# EAGLE design Un_Usb (EAGLE 6.2)
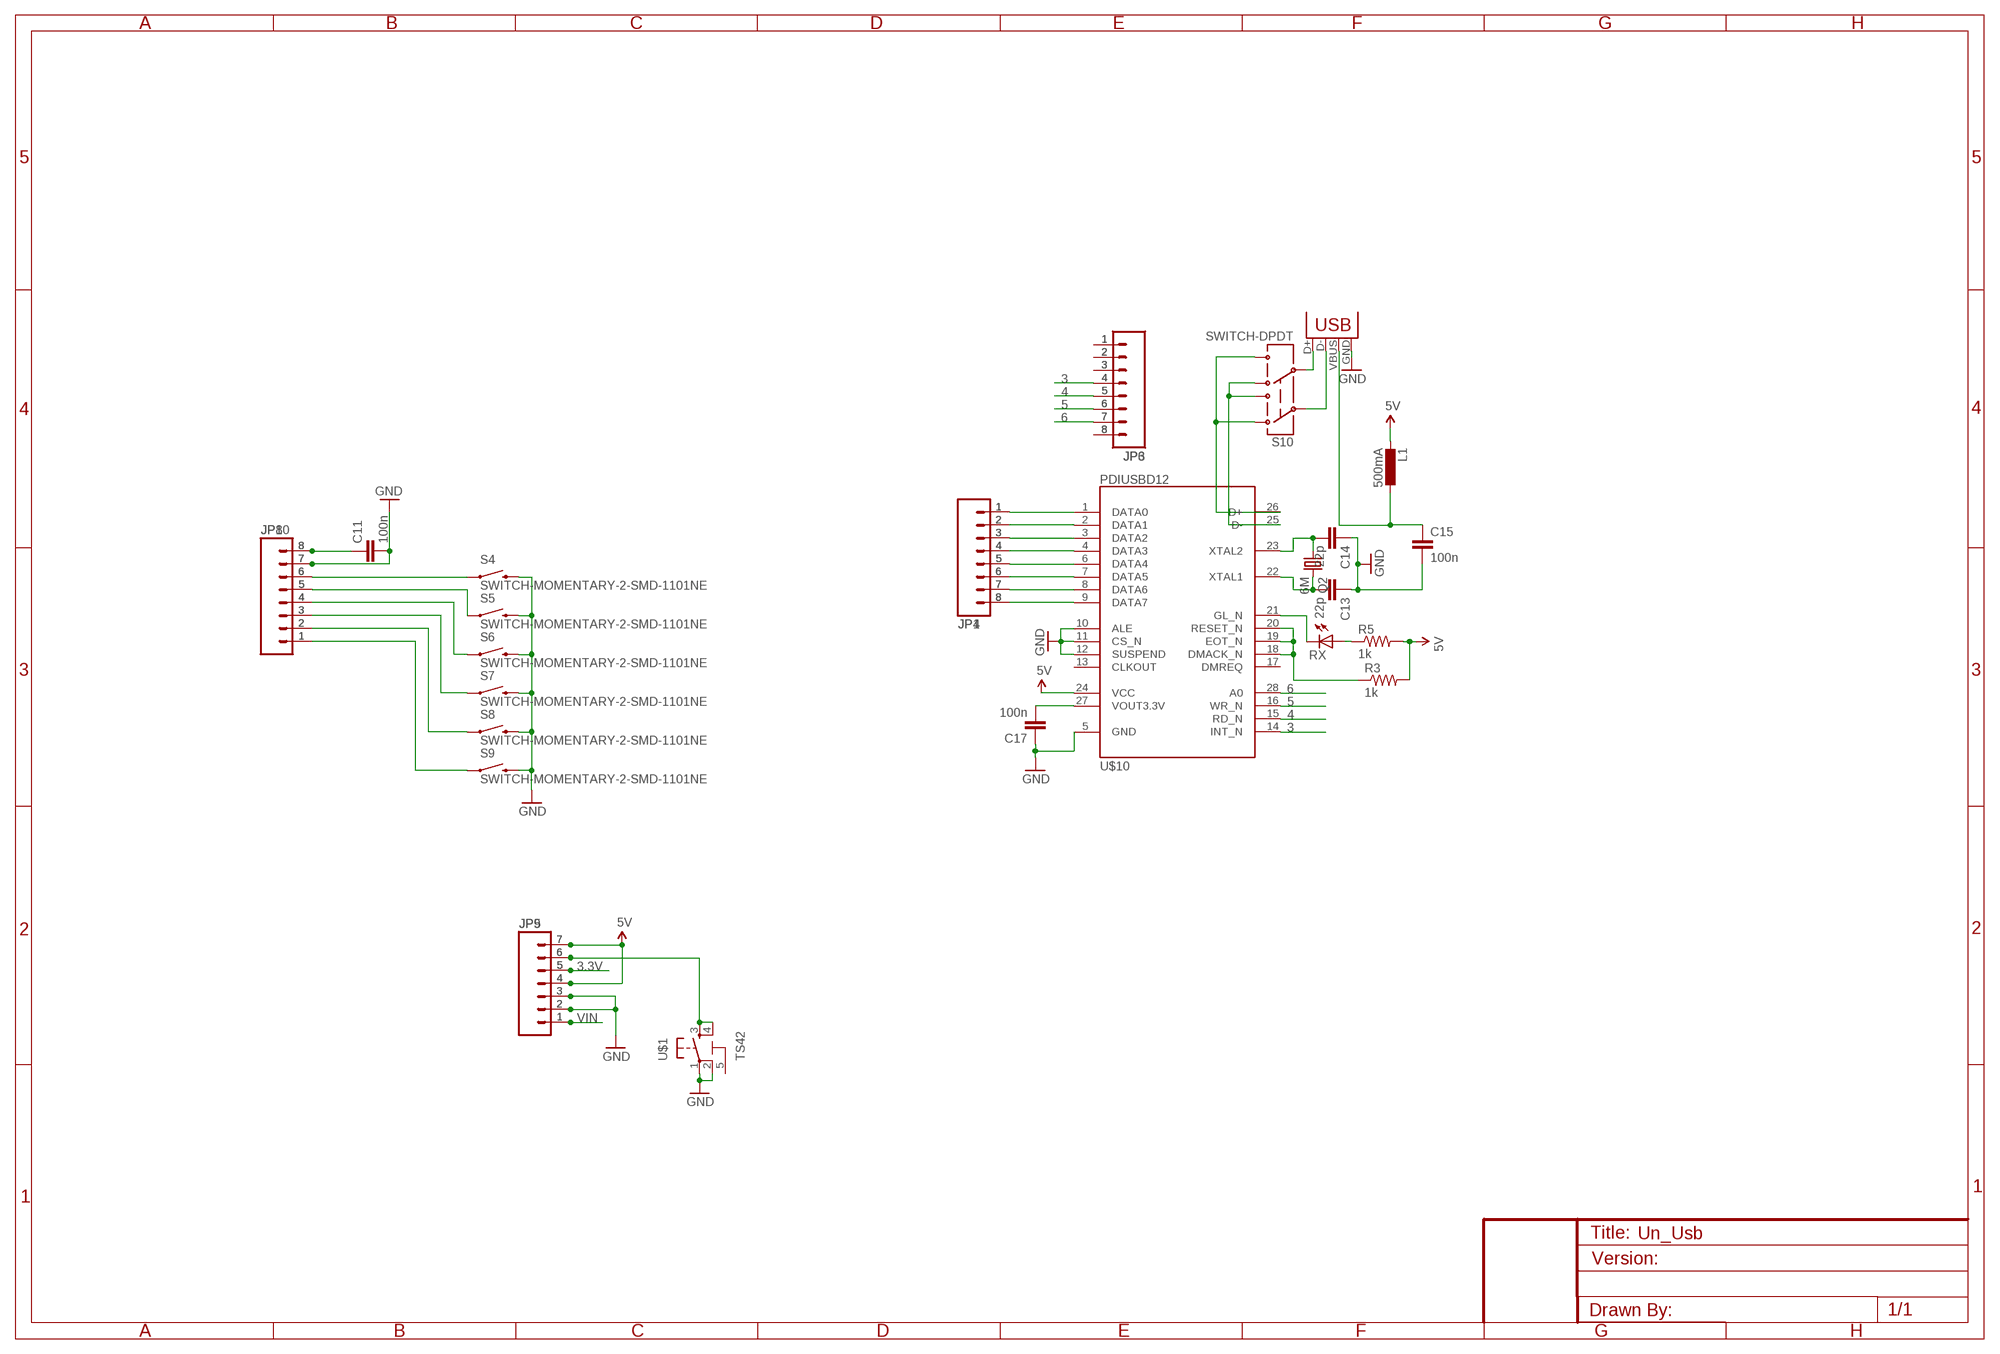
[diagram p0: schematic, sheet 1]

## Parts
C11  100n  CAP0603-CAP  [0603-CAP]
C13  22p  CAP0805  [0805]
C14  22p  CAP0805  [0805]
C15  100n  CAP0603-CAP  [0603-CAP]
C17  100n  CAP0603-CAP  [0603-CAP]
JP1  M081X08  [1X08]
JP3  M08  [1X08]
JP4  M081X08  [1X08]
JP5  M07  [1X07]
JP6  M08  [1X08]
JP8  M08  [1X08]
JP9  M07  [1X07]
JP10  M08  [1X08]
L1  500mA  L-EUL1812  [L1812]
Q2  6M  CRYSTALHC49US  [HC49US]
R3  1k  RESISTOR0805-RES  [0805]
R5  1k  RESISTOR0805-RES  [0805]
RX  LED0805  [LED-0805]
S4  SWITCH-MOMENTARY-2-SMD-1101NE  [TACTILE-SWITCH-1101NE]
S5  SWITCH-MOMENTARY-2-SMD-1101NE  [TACTILE-SWITCH-1101NE]
S6  SWITCH-MOMENTARY-2-SMD-1101NE  [TACTILE-SWITCH-1101NE]
S7  SWITCH-MOMENTARY-2-SMD-1101NE  [TACTILE-SWITCH-1101NE]
S8  SWITCH-MOMENTARY-2-SMD-1101NE  [TACTILE-SWITCH-1101NE]
S9  SWITCH-MOMENTARY-2-SMD-1101NE  [TACTILE-SWITCH-1101NE]
S10  SWITCH-DPDT  [SWITCH-P2]
U$1  TS42  [TS42]
U$10  PDIUSBD12  [TSSOP28]
X2  USB  [USB-A-M]

## Nets
2: JP3.3 JP6.3
3: JP3.4 JP6.4 U$10.14(INT_N)
3.3V: JP5.5 JP9.5
4: JP3.5 JP6.5 U$10.15(RD_N)
5: JP3.6 JP6.6 U$10.16(WR_N)
5V: JP5.4 JP5.7 JP9.4 JP9.7 L1.2 R3.2 R5.2 U$10.24(VCC)
6: JP3.7 JP6.7 U$10.28(A0)
A0: JP1.1 JP4.1 U$10.1(DATA0)
AREF: C11.1 JP8.8 JP10.8
D+: S10.1 S10.6 U$10.26(D+)
D-: S10.3 S10.4 U$10.25(D-)
GND: C11.2 C13.1 C14.1 C15.2 C17.1 JP5.2 JP5.3 JP8.7 JP9.2 JP9.3 JP10.7 S4.P$2 S5.P$2 S6.P$2 S7.P$2 S8.P$2 S9.P$2 U$1.1 U$1.2 U$10.5(GND) U$10.10(ALE) U$10.11(CS_N) U$10.12(SUSPEND) X2.GND
IO0: JP3.1 JP6.1
N$1: JP1.8 JP4.8 U$10.9(DATA7)
N$2: JP3.8 JP6.8
N$3: JP1.7 JP4.7 U$10.8(DATA6)
N$5: JP1.6 JP4.6 U$10.7(DATA5)
N$6: JP1.5 JP4.5 U$10.6(DATA4)
N$7: R5.1 RX.1(A)
N$8: JP1.4 JP4.4 U$10.4(DATA3)
N$10: JP8.1 JP10.1 S9.P$1
N$11: JP8.2 JP10.2 S8.P$1
N$12: JP8.3 JP10.3 S7.P$1
N$13: JP8.5 JP10.5 S5.P$1
N$14: JP8.6 JP10.6 S4.P$1
N$15: JP8.4 JP10.4 S6.P$1
N$21: C15.1 L1.1 X2.VBUS
N$22: C13.2 Q2.2 U$10.22(XTAL1)
N$23: JP3.2 JP6.2
N$30: C14.2 Q2.1 U$10.23(XTAL2)
N$31: JP1.2 JP4.2 U$10.2(DATA1)
N$32: JP1.3 JP4.3 U$10.3(DATA2)
N$35: C17.2 U$10.27(VOUT3.3V)
N$36: RX.2(C) U$10.21(GL_N)
N$37: R3.1 U$10.18(DMACK_N) U$10.19(EOT_N) U$10.20(RESET_N)
N$38: JP5.6 JP9.6 U$1.3 U$1.4
UD+: S10.5 X2.D+
UD-: S10.2 X2.D-
VIN: JP5.1 JP9.1
Unconnected: U$1.5 U$10.13(CLKOUT) U$10.17(DMREQ)

## Library data of the parts
C11 C13-C15 C17 = 1SparkFun:CAP: Capacitor Standard 0603 ceramic capacitor, and 0.1" leaded capacitor.
JP1 JP4 = 2SparkFun:M08: Header 8 Standard 8-pin 0.1" header. Use with straight break away headers (SKU : PRT-00116), right angle break away headers (PRT-00553), swiss pins (PRT-00743), machine pins (PRT-00117), and female headers (PRT-00115).
JP3 JP6 JP8 JP10 = 1SparkFun:M08: Header 8 Standard 8-pin 0.1" header. Use with straight break away headers (SKU : PRT-00116), right angle break away headers (PRT-00553), swiss pins (PRT-00743), machine pins (PRT-00117), and female headers (PRT-00115).
JP5 JP9 = 2SparkFun:M07: Header 7 Standard 7-pin 0.1" header. Use with straight break away headers (SKU : PRT-00116), right angle break away headers (PRT-00553), swiss pins (PRT-00743), machine pins (PRT-00117), and female headers (PRT-00115). NOTES ON THE VARIANTS LOCK and LOCK_LONGPADS... This footprint was designed to help hold the alignment of a through-hole component (i.e. 7-pin header) while soldering it into place. You may notice that each hole has been shifted either up or down by 0.005 of an inch from it's more standard position (which is usually a perfectly straight line). This slight alteration caused the pins (the squares in the middle) to touch the edges of the holes. Because they are alternating, it causes a "brace" to hold the header in place. 0.005 has proven to be the perfect amount of "off-center" position when using our standard breakaway headers. Although looks a little odd when you look at the bare footprint, once you have a header in there, the alteration is very hard to notice. Also, if you push a header all the way into place, it is covered up entirely on the bottom side. This idea of altering the position of holes to aid alignment will be further integrated into the Sparkfun Library for other footprints. It can help hold any component with 3 or more connection pins.
L1 = rcl:L-EU: INDUCTOR, European symbol
Q2 = 1SparkFun:CRYSTAL: Crystals Various standard crystals. Proven footprints. Spark Fun Electronics SKU : COM-00534
R3 R5 = 2SparkFun:RESISTOR: Resistor Basic schematic elements and footprints for 0603, 1206, and PTH resistors.
RX = 1SparkFun:LED: LEDs Standard schematic elements and footprints for 5mm, 3mm, 1206, and 0603 sized LEDs. 5mm - Spark Fun Electronics SKU : COM-00529 (and others)
S4-S9 = 2SparkFun:SWITCH-MOMENTARY-2
S10 = 2SparkFun:SWITCH-DPDT: DPDT Version of the COM-00597
U$1 = 2SparkFun:TS42
U$10 = 2SparkFun:PDIUSBD12
X2 = 0SparkFun:USB: USB Connectors USB-B-PTH is fully proven SKU : PRT-00139 USB-miniB is fully proven SKU : PRT-00587 USB-A-PCB is untested. USB-A-H is throughly reviewed, but untested. Spark Fun Electronics SKU : PRT-00437 USB-B-SMT is throughly reviewed, but untested. Needs silkscreen touching up. USB-A-S has not been used/tested USB-MB-H has not been used/tested

## Net classes
0 default: width 0.254 mm, clearance 0.254 mm
1 power: width 0.61 mm, drill 0.61 mm, clearance 0.254 mm
2 gnd: width 0.305 mm, drill 0.559 mm, clearance 0.254 mm
3 usbvcc: width 0.508 mm, drill 0.61 mm, clearance 0.254 mm
4 aref: width 0.406 mm, drill 0.61 mm, clearance 0.254 mm

## Board
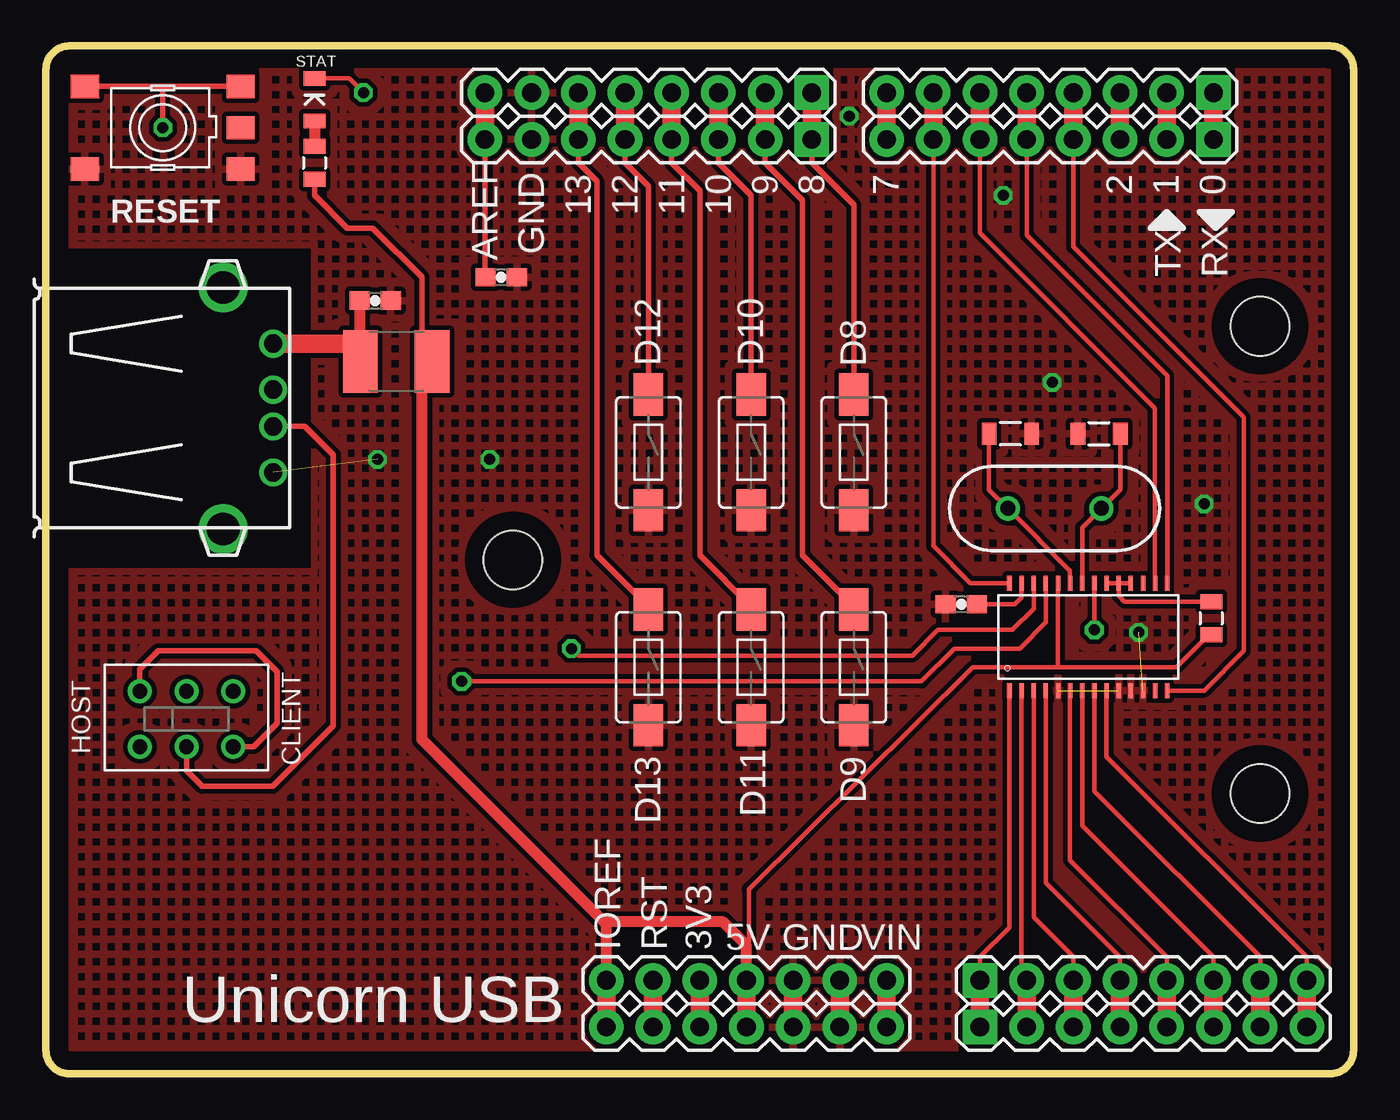
[diagram p1: board, top side]
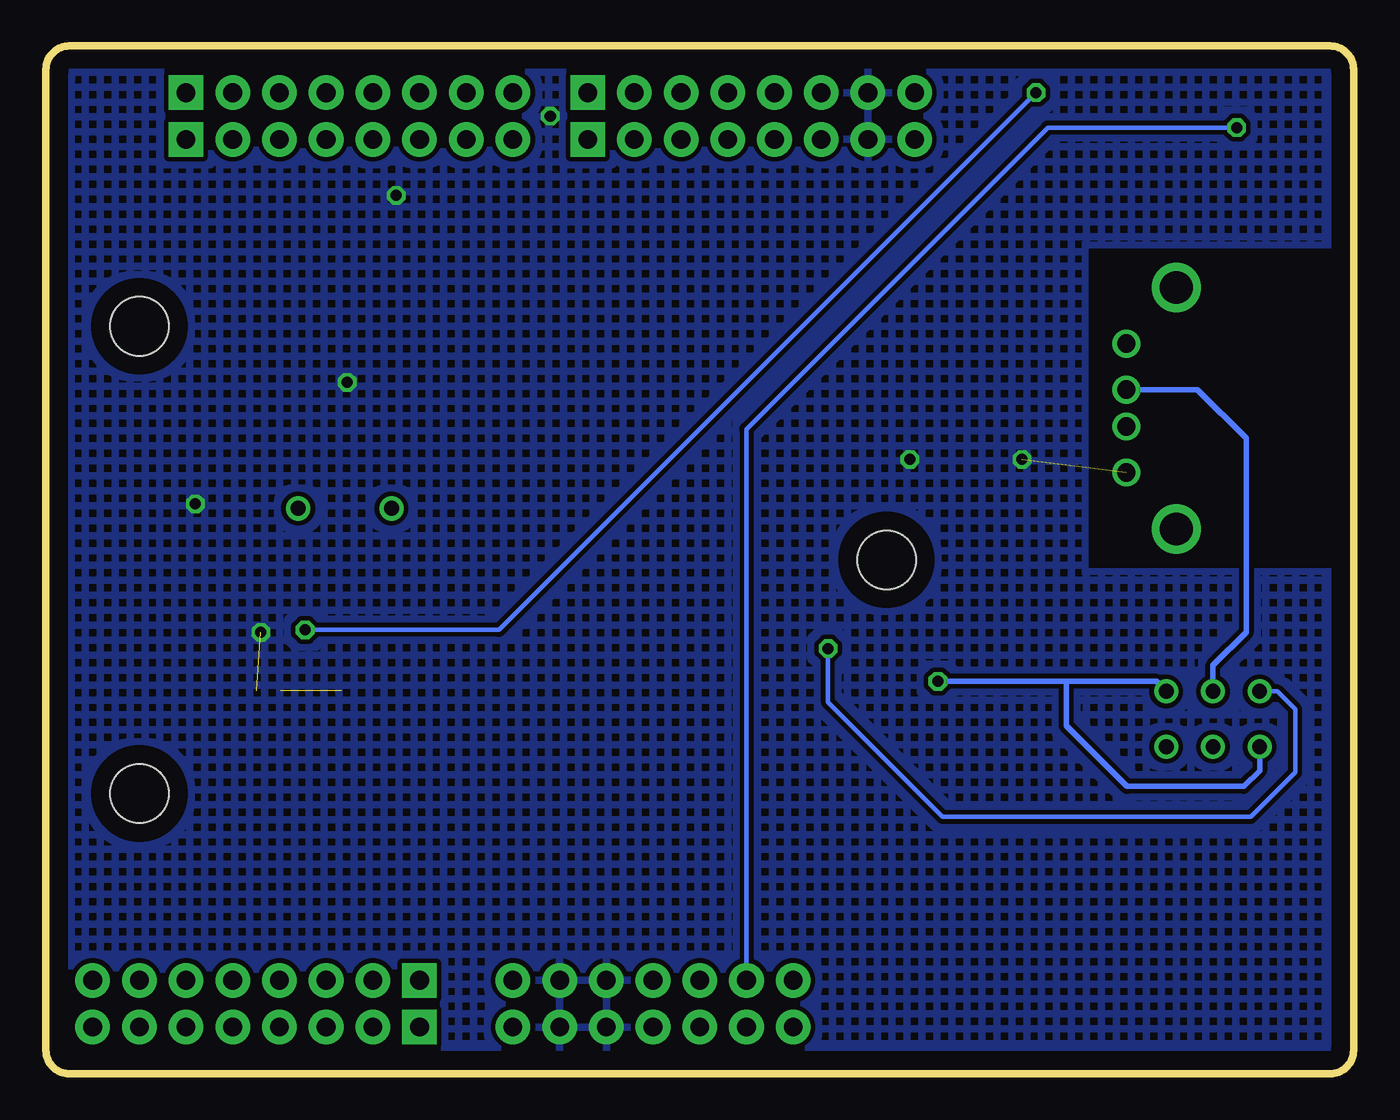
[diagram p2: board, bottom side, seen from below]

Size 71.12 x 55.88 mm. Coordinates in mm from the lower left corner, seen from the top.
Outline: 1.27,0 69.85,0 arc90 71.12,1.27 71.12,54.61 arc90 69.85,55.88 1.27,55.88 arc90 0,54.61 0,1.27 arc90 1.27,0
Copper layers (1*16): Top 0.035mm / dielectric 1.5mm / Bottom 0.035mm
Design rules: minimum track width 10mil, minimum drill 24mil, track to track 8mil, track to pad 8mil, pad to pad 8mil, via to via 8mil, smd to smd 8mil, copper to edge 40mil, drill to drill 8mil, minimum pad ring 10mil, minimum via ring 8mil, stop-mask expansion 4mil, vias tented up to drill 0mil, thermal gap 10mil
Holes 3.2 mm at 66.04,40.64 66.04,15.24 25.4,27.94

### Footprints (pad centres in the part's own frame; a part is rotated, then mirrored left to right if it is on the bottom)
0603-CAP = smd 1.1 x 1: 1 -0.85,0; 2 0.85,0
0805 = smd 0.8 x 1.2: 1 -1.154,0; 2 1.154,0
1X08 = drill 1.016 pad 1.88 square: 1 0,0 | drill 1.016 pad 1.88: 2 2.54,0; 3 5.08,0; 4 7.62,0; 5 10.16,0; 6 12.7,0; 7 15.24,0; 8 17.78,0
1X07 = drill 1.016 pad 1.88: 1 0,0; 2 2.54,0; 3 5.08,0; 4 7.62,0; 5 10.16,0; 6 12.7,0; 7 15.24,0
L1812 = smd 1.9 x 3.4: 1 -1.95,0; 2 1.95,0
HC49US = drill 0.813: 1 -2.54,0; 2 2.54,0
0805' = smd 0.8 x 1.2: 1 -0.9,0; 2 0.9,0
LED-0805 = smd 0.8 x 1.2: 1 -1.154,0; 2 1.154,0
TACTILE-SWITCH-1101NE = smd 2.3 x 1.6: P$1 -3.15,0; P$2 3.15,0
SWITCH-P2 = drill 0.8: 1 0,3.01; 2 2.54,3.01; 3 5.08,3.01; 4 0,0; 5 2.54,0; 6 5.08,0
TS42 = smd 1.524 x 1.27: 1 -4.229,2.25; 2 4.229,2.25; 3 -4.229,-2.25; 4 4.229,-2.25; 5 -4.229,-0.002
TSSOP28 = smd 0.8 x 0.25: 1 -2.921,4.623; 2 -2.921,3.962; 3 -2.921,3.302; 4 -2.921,2.642; 5 -2.921,1.981; 6 -2.921,1.321; 7 -2.921,0.66; 8 -2.927,0; 9 -2.921,-0.66; 10 -2.921,-1.321; 11 -2.921,-1.981; 12 -2.921,-2.642; 13 -2.921,-3.302; 14 -2.921,-3.962; 15 2.921,-3.962; 16 2.921,-3.302; 17 2.921,-2.642; 18 2.921,-1.981; 19 2.921,-1.321; 20 2.921,-0.66; 21 2.927,0; 22 2.921,0.66; 23 2.921,1.321; 24 2.921,1.981; 25 2.921,2.642; 26 2.921,3.302; 27 2.921,3.962; 28 2.921,4.623
USB-A-M = drill 1: D+ 1,12.99; D- -1,12.99; GND 3.5,12.99; VBUS -3.5,12.99 | drill 1.778: GND@1 6.579,10.278; GND@2 -6.553,10.278

### Placement (x,y rotation side)
C11  24.77,43.31 0 top
C13  57.28,34.8 0 top
C14  52.45,34.8 180 top
C15  17.91,42.04 0 top
C17  49.78,25.53 0 top
JP1  50.8,5.08 0 top
JP3  63.5,53.34 180 top
JP4  50.8,2.54 0 top
JP5  45.72,2.54 180 top
JP6  63.5,50.8 180 top
JP8  41.66,50.8 180 top
JP9  45.72,5.08 180 top
JP10  41.66,53.34 180 top
L1  19.05,38.73 0 top
Q2  54.86,30.73 0 top
R3  1k  [0805']  63.37,24.77 270 top
R5  1k  [0805']  14.61,49.53 270 top
RX  14.61,52.96 90 top
S4  32.77,22.1 270 top
S5  32.77,33.78 270 top
S6  38.35,22.1 270 top
S7  38.35,33.78 270 top
S8  43.94,22.1 270 top
S9  43.94,33.78 270 top
S10  5.11,17.78 0 top
U$1  6.35,51.44 180 top
U$10  57.02,23.75 90 top
X2  -0.63,36.2 270 top

### Tracks (layer width: path | path; a pad name or v marks a point on that pad's centre or on a via)
2
  Top 1.016: JP3.3 JP6.3
3
  Top 0.254: U$10.14 62.99,20.83 65.15,22.99 65.15,35.69 55.88,44.96 JP6.4
  Top 1.016: JP3.4 JP6.4
3.3V
  Top 1.016: JP5.5 JP9.5
4
  Top 0.254: U$10.15 60.98,37.95 53.34,45.59 JP6.5
  Top 1.016: JP3.5 JP6.5
5
  Top 0.254: JP6.6 50.8,45.72 60.33,36.2 U$10.16
  Top 1.016: JP3.6 JP6.6
5V
  Top 0.254: R3.2 63.11,23.86 63.11,23.74 61.47,22.1 55.12,22.1 | 55.12,22.1 50.42,22.1 38.23,10.03 38.23,5.21 JP9.4 | U$10.24 55.04,22.17 55.12,22.1
  Top 0.305: 20.45,39.37 20.45,43.31 17.78,45.97 16.38,45.97 14.61,47.75 R5.2
  Top 0.61: JP9.4 38.1,6.99 36.83,8.26 30.61,8.26 30.48,8.13 | JP9.7 30.48,8.13 | 30.48,8.13 20.45,18.16 20.45,39.37 L1.2
  Top 1.016: JP5.7 JP9.7 | JP5.4 JP9.4
6
  Top 0.254: JP6.7 48.26,28.7 50.29,26.67 U$10.28
  Top 1.016: JP3.7 JP6.7
A0
  Top 0.254: U$10.1 52.4,7.95 50.8,6.35 JP1.1
  Top 1.016: JP1.1 JP4.1
AREF
  Top 0.305: JP8.8 23.88,43.35 C11.1
  Top 1.016: JP10.8 JP8.8
D+  (via drill 0.6)
  Top 0.254: U$10.26 53.72,25.27 52.58,24.13 48.51,24.13 47.12,22.73 28.96,22.73 v28.58,23.11
  Top 0.305: S10.1 5.11,22 6.1,22.99 11.43,22.99 12.57,21.84 12.57,19.05 11.3,17.78 S10.6
  Bottom 0.254: S10.1 4.15,20.79 3.17,19.81 3.17,16.38 5.59,13.97 22.35,13.97 28.58,20.19 v28.58,23.11
D-  (via drill 0.6)
  Top 0.254: U$10.25 54.38,24.54 52.96,23.11 49.4,23.11 47.62,21.34 v22.61,21.34
  Bottom 0.305: S10.4 5.11,16.48 5.97,15.62 12.32,15.62 15.62,18.92 15.62,21.34 | S10.3 10.73,21.34 15.62,21.34 | 15.62,21.34 v22.61,21.34
GND  (via drill 0.6)  (3 unrouted)
  Top 1.016: JP5.2 JP9.2 | JP5.3 JP9.3
  other vias: 24.13,33.4 43.69,52.07 18.03,33.4 62.99,30.99 59.44,24 54.74,37.59 52.07,47.75
  pour Top (hatched): 0,55.88 71.12,55.88 71.12,0 0,0 0,27.3 14.61,27.3 14.61,45.09 0,45.09
  pour Bottom (hatched): 0,55.88 71.12,55.88 71.12,0 0,0 0,27.3 14.61,27.3 14.61,45.09 0,45.09
IO0
  Top 1.016: JP3.1 JP6.1
N$1
  Top 0.254: U$10.9 57.68,17.25 68.58,6.35 JP1.8
  Top 1.016: JP1.8 JP4.8
N$2
  Top 1.016: JP3.8 JP6.8
N$3
  Top 0.254: U$10.8 57.02,15.37 66.04,6.35 JP1.7
  Top 1.016: JP1.7 JP4.7
N$5
  Top 0.254: U$10.7 56.36,13.49 63.5,6.35 JP1.6
  Top 1.016: JP1.6 JP4.6
N$6
  Top 0.254: U$10.6 55.7,11.61 60.96,6.35 JP1.5
  Top 1.016: JP1.5 JP4.5
N$7
  Top 0.61: RX.1 R5.1
N$8
  Top 0.254: U$10.4 54.38,10.39 58.42,6.35 JP1.4
  Top 1.016: JP4.4 JP1.4
N$10
  Top 0.305: S9.P$1 43.94,47.24 41.66,49.53 JP8.1
  Top 1.016: JP10.1 JP8.1
N$11
  Top 0.305: JP8.2 39.12,49.53 41.15,47.5 41.15,28.19 43.94,25.4 S8.P$1
  Top 1.016: JP10.2 JP8.2
N$12
  Top 0.305: S7.P$1 38.35,47.75 36.58,49.53 JP8.3
  Top 1.016: JP10.3 JP8.3
N$13
  Top 0.305: 31.75,50.55 JP8.5 31.5,49.53 32.77,48.26 S5.P$1
  Top 1.016: JP10.5 JP8.5
N$14
  Top 0.305: JP8.6 28.96,49.53 29.97,48.51 29.97,28.19 32.77,25.4 S4.P$1
  Top 1.016: JP10.6 JP8.6
N$15
  Top 0.305: 38.35,25.53 S6.P$1 38.35,25.4 35.56,28.19 35.56,48.01 34.04,49.53 JP8.4
  Top 1.016: JP10.4 JP8.4
N$21
  Top 0.61: C15.1 17.06,39.41 L1.1
  Top 1.016: X2.VBUS 17.1,39.7 L1.1
N$22
  Top 0.254: C13.2 58.43,31.76 Q2.2 56.36,29.69 U$10.22
N$23
  Top 1.016: JP3.2 JP6.2
N$30
  Top 0.254: 52.4,30.66 Q2.1 | C14.2 51.3,31.76 Q2.1 | U$10.23 55.7,27.36 Q2.1
N$31
  Top 0.254: U$10.2 53.06,5.36 JP1.2
  Top 1.016: JP4.2 JP1.2
N$32
  Top 0.254: U$10.3 53.72,8.51 55.88,6.35 JP1.3
  Top 1.016: JP1.3 JP4.3
N$35
  Top 0.254: U$10.27 53.06,25.88 52.7,25.53 C17.2
N$36  (via drill 0.6)
  Top 0.254: U$10.21 v57.02,24.13 | v17.27,53.34 16.5,54.11 RX.2
  Bottom 0.254: v17.27,53.34 46.48,24.13 v57.02,24.13
N$37
  Top 0.254: U$10.19 U$10.20 | U$10.19 58.34,25.98 58.66,25.66 R3.1 | U$10.18 U$10.19
N$38  (via drill 0.6)
  Top 0.305: U$1.4 6.35,53.69 | 6.35,53.69 U$1.3 | v6.35,51.44 6.35,53.69
  Top 1.016: JP5.6 JP9.6
  Bottom 0.254: v6.35,51.44 16.64,51.44 33.02,35.05 JP9.6
UD+
  Top 0.305: X2.D+ 14.08,35.2 15.62,33.66 15.62,18.92 12.32,15.62 8.51,15.62 7.62,16.51 7.64,16.54 S10.5
UD-
  Bottom 0.305: X2.D- 8.49,37.2 5.84,34.54 5.84,24 7.64,22.2 S10.2
VIN
  Top 1.016: JP5.1 JP9.1

### Text on the board
tPlace: STAT | 7 | 2 | 1 | 0 | D12 | D10 | D8 | D11 | HOST | CLIENT | D13 | D9 | Unicorn USB
tNames: AREF | GND | 13 | 12 | 11 | 10 | 9 | 8 | RESET | TX | RX | IOREF | RST | 3V3 | 5V | GND | VIN